# Altium schematic sheet hbridge.SchDoc
size A
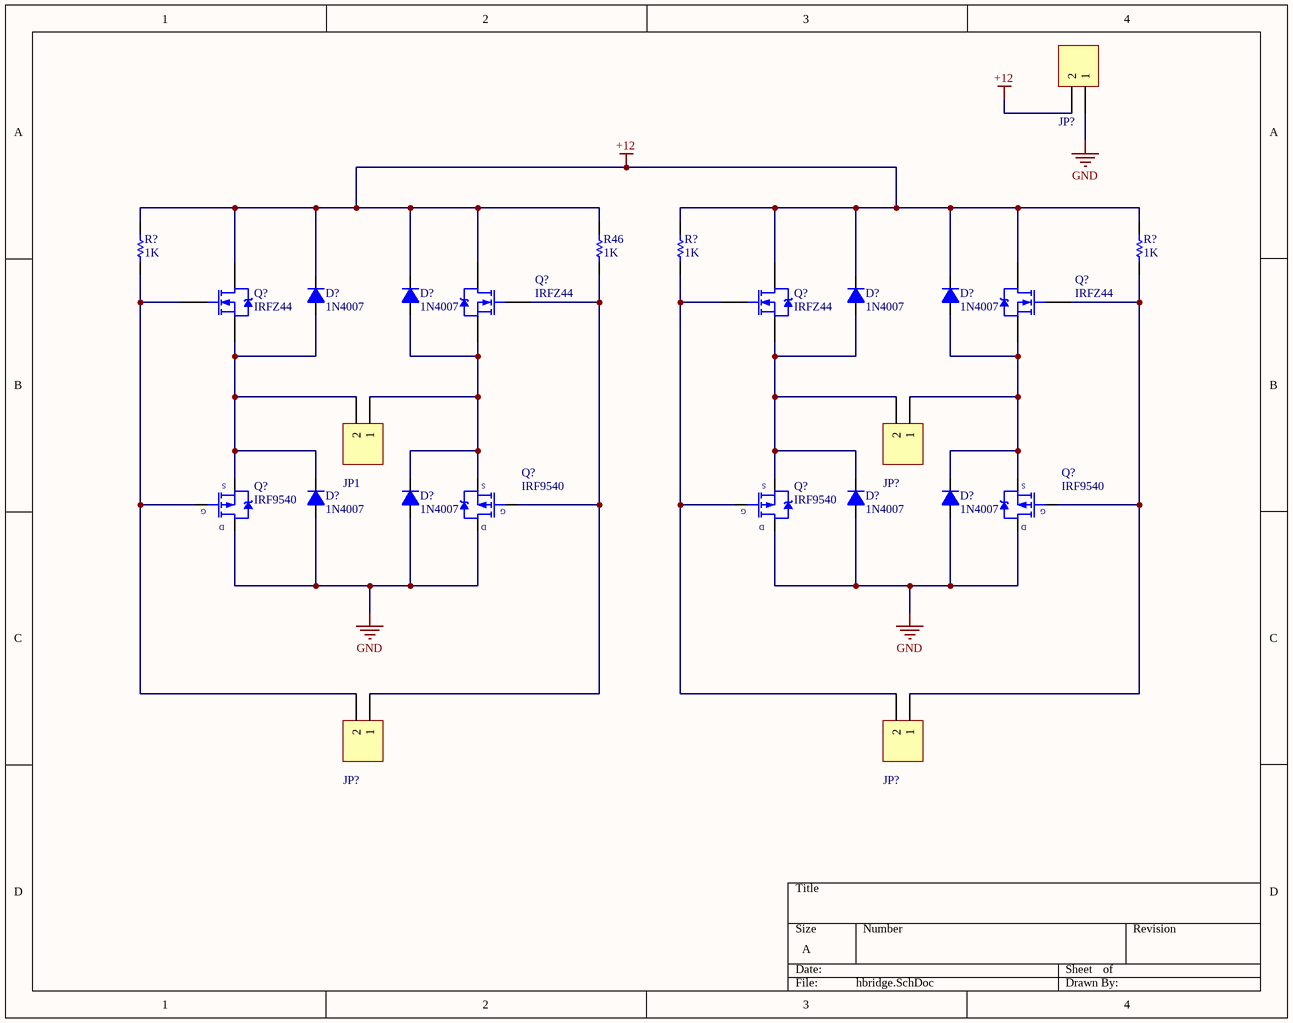
[diagram p0: hbridge.SchDoc]

## Parts
(Parts that share a designator on the sheet are numbered #1, #2 ... from top to bottom, then left to right.)
D?#1  1N4007  [D2A]
D?#2  1N4007  [D2A]
D?#3  1N4007  [D2A]
D?#4  1N4007  [D2A]
D?#5  1N4007  [D2A]
D?#6  1N4007  [D2A]
D?#7  1N4007  [D2A]
D?#8  1N4007  [D2A]
JP1  Header 2_1  [HED2]  (value not drawn)
JP?#1  Header 2_1  [HED2]  (value not drawn)
JP?#2  Header 2_1  [HED2]  (value not drawn)
JP?#3  Header 2_1  [HED2]  (value not drawn)
JP?#4  Header 2_1  [HED2]  (value not drawn)
Q?#1  IRFZ44  [QTO-220H3]
Q?#2  IRFZ44  [QTO-220H3]
Q?#3  IRFZ44  [QTO-220H3]
Q?#4  IRFZ44  [QTO-220H3]
Q?#5  IRF9540  [QTO-220]
Q?#6  IRF9540  [QTO-220]
Q?#7  IRF9540  [QTO-220]
Q?#8  IRF9540  [QTO-220]
R46  value 1K  [R1/4W]  (hidden comment: Res1)
R?#1  value 1K  [R1/4W]  (hidden comment: Res1)
R?#2  value 1K  [R1/4W]  (hidden comment: Res1)
R?#3  value 1K  [R1/4W]  (hidden comment: Res1)

## Nets
+12: D?#1.2(K) D?#2.2(K) D?#3.2(K) D?#4.2(K) JP?#1.2 Q?#1.2(D) Q?#2.2(D) Q?#3.2(D) Q?#4.2(D) R46.2 R?#1.2 R?#2.2 R?#3.2
GND: D?#5.1(A) D?#6.1(A) D?#7.1(A) D?#8.1(A) JP?#1.1 Q?#5.2(D) Q?#6.2(D) Q?#7.2(D) Q?#8.2(D)
NetD?#1_1: D?#1.1(A) D?#5.2(K) JP1.2 Q?#1.3(S) Q?#5.3(S)
NetD?#2_1: D?#2.1(A) D?#6.2(K) JP1.1 Q?#2.3(S) Q?#6.3(S)
NetD?#3_1: D?#3.1(A) D?#7.2(K) JP?#2.2 Q?#3.3(S) Q?#7.3(S)
NetD?#4_1: D?#4.1(A) D?#8.2(K) JP?#2.1 Q?#4.3(S) Q?#8.3(S)
NetJP?#3_1: JP?#3.1 Q?#2.1(G) Q?#6.1(G) R46.1
NetJP?#3_2: JP?#3.2 Q?#1.1(G) Q?#5.1(G) R?#1.1
NetJP?#4_1: JP?#4.1 Q?#4.1(G) Q?#8.1(G) R?#3.1
NetJP?#4_2: JP?#4.2 Q?#3.1(G) Q?#7.1(G) R?#2.1

## Library data of the parts
D?#1-D?#8 = D1A: Diode 1A; Value: 1N4007
JP1 JP?#1-JP?#4 = Header 2_1: Header, 2-Pin; Manufacturer: Generic Components; Class: Connector; Value: Header 2
Q?#1-Q?#4 = IRFZ44: HEXFET N-Channel Power MOSFET
Q?#5-Q?#8 = IRF9540: HEXFET P-Channel Power MOSFET; Note: Pin 2 is electrically connected to pin 4.; Published: 8-Jun-2000; LatestRevisionDate: 17-Jul-2002; LatestRevisionNote: Re-released for DXP Platform.; DatasheetVersion: PD-9.421C; PackageVersion: Feb-1997; PackageReference: TO-220AB; Publisher: Altium Limited; PackageDescription: TO, Thru-Hole, Vertical, Heatsink Mounted; 3 In-Line Leads; Pitch 2.54 mm; ComponentLink1Description: Manufacturer Link; ComponentLink1URL: http://www.irf.com/; ComponentLink2Description: Datasheet; ComponentLink2URL: http://www.irf.com/product-info/datasheets/data/irf9540.pdf
R46 R?#1-R?#3 = Res1_4: Resistor; Manufacturer: Generic Components; Class: Passive; Published: 08/06/2000; Publisher: Altium Hobart Technology Centre; SubClass: Resistor